# Altium schematic sheet Model3_v1.0.SchDoc
size 71 x 60 mm
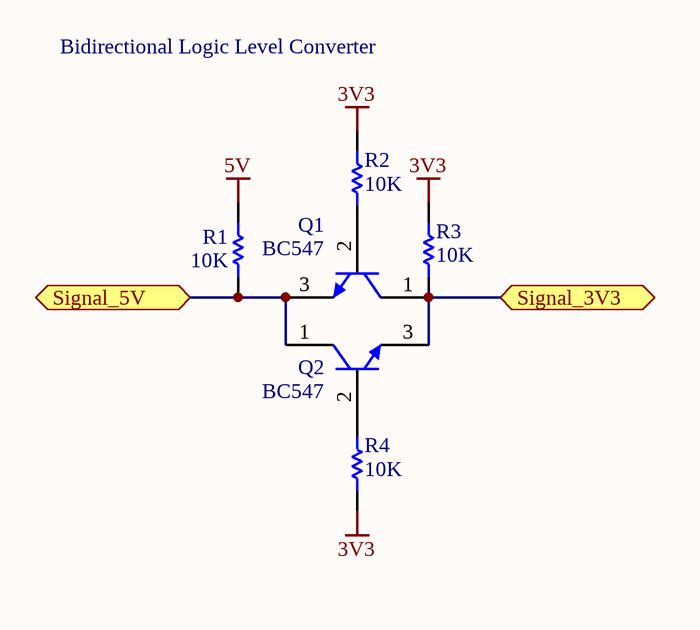
[diagram p0: Model3_v1.0.SchDoc]

## Parts
Q1  BC547  [TO92_3Pin]
Q2  BC547  [TO92_3Pin]
R1  10K  [SMD_0805]
R2  10K  [SMD_0805]
R3  10K  [SMD_0805]
R4  10K  [SMD_0805]

## Ports
Signal_3V3 (bidir), Signal_5V (bidir)

## Nets
3V3: R2.2 R3.2 R4.1
5V: R1.2
Signal_3V3: Q1.1(C) Q2.3(E) R3.1 ; port Signal_3V3
Signal_5V: Q1.3(E) Q2.1(C) R1.1 ; port Signal_5V
NetQ1_2: Q1.2(B) R2.1
NetQ2_2: Q2.2(B) R4.2

## Notes on the sheet
- (near R2) Bidirectional Logic Level Converter

## Library data of the parts
Q1 Q2 = Transistor_BJT_NPN_cbe: Transistor, BJT, NPN; Package Reference: TO-92A
R1-R4 = Resistor: Resistor, 1/4W, 5%; Revision: July-2002: Re-released for DXP Platform.